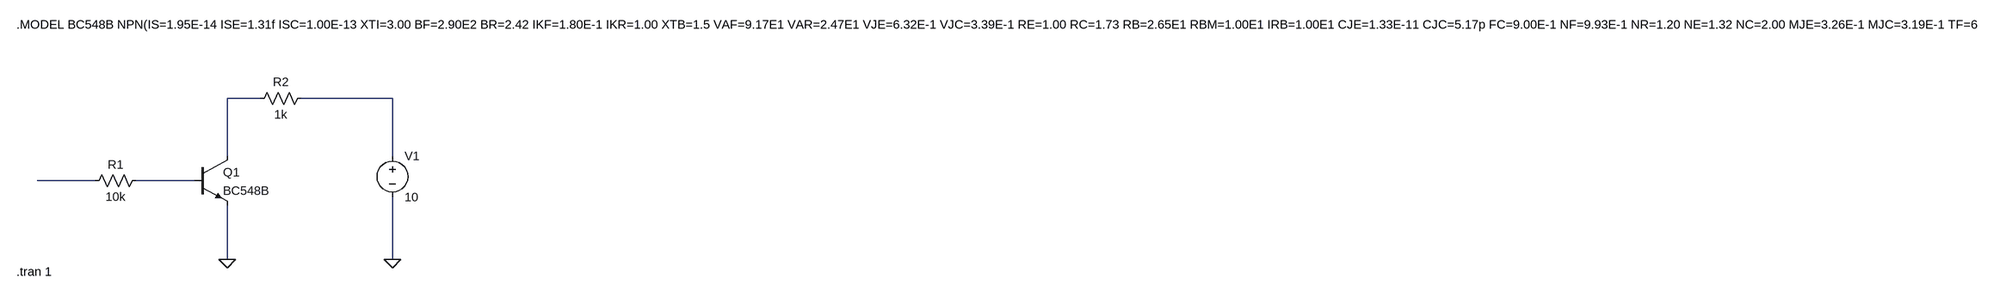
[diagram p0: schematic trans_corte.asc]
trans_corte.asc, the LTspice schematic file:
Version 4.1
SHEET 1 5068 680
WIRE 320 0 256 0
WIRE 576 0 400 0
WIRE 256 112 256 0
WIRE 576 112 576 0
WIRE 0 160 -112 160
WIRE 192 160 80 160
WIRE 256 320 256 208
WIRE 576 320 576 192
FLAG 256 320 0
FLAG 576 320 0
SYMBOL res 96 144 R90
WINDOW 0 0 56 VBottom 2
WINDOW 3 32 56 VTop 2
SYMATTR InstName R1
SYMATTR Value 10k
SYMBOL res 416 -16 R90
WINDOW 0 0 56 VBottom 2
WINDOW 3 32 56 VTop 2
SYMATTR InstName R2
SYMATTR Value 1k
SYMBOL voltage 576 96 R0
SYMATTR InstName V1
SYMATTR Value 10
SYMBOL npn 192 112 R0
SYMATTR InstName Q1
SYMATTR Value BC548B
TEXT -152 -144 Left 2 !.MODEL BC548B NPN(IS=1.95E-14 ISE=1.31f ISC=1.00E-13 XTI=3.00 BF=2.90E2 BR=2.42 IKF=1.80E-1 IKR=1.00 XTB=1.5 VAF=9.17E1 VAR=2.47E1 VJE=6.32E-1 VJC=3.39E-1 RE=1.00 RC=1.73 RB=2.65E1 RBM=1.00E1 IRB=1.00E1 CJE=1.33E-11 CJC=5.17p FC=9.00E-1 NF=9.93E-1 NR=1.20 NE=1.32 NC=2.00 MJE=3.26E-1 MJC=3.19E-1 TF=6.52E-10 TR=0 ITF=1.03 VTF=1.65 XTF=1.00E2 EG=1.11 VCEO=30 ICRATING=100m MFG=PHILIPS)
TEXT -152 344 Left 2 !.tran 1

The netlist it stands for:
* trans_corte.asc
R1 N004 N003 10k
R2 N002 N001 1k
V1 N002 0 10
Q1 N001 N004 0 0 BC548B
.model NPN NPN
.model PNP PNP
.lib standard.bjt
.MODEL BC548B NPN(IS=1.95E-14 ISE=1.31f ISC=1.00E-13 XTI=3.00 BF=2.90E2 BR=2.42 IKF=1.80E-1 IKR=1.00 XTB=1.5 VAF=9.17E1 VAR=2.47E1 VJE=6.32E-1 VJC=3.39E-1 RE=1.00 RC=1.73 RB=2.65E1 RBM=1.00E1 IRB=1.00E1 CJE=1.33E-11 CJC=5.17p FC=9.00E-1 NF=9.93E-1 NR=1.20 NE=1.32 NC=2.00 MJE=3.26E-1 MJC=3.19E-1 TF=6.52E-10 TR=0 ITF=1.03 VTF=1.65 XTF=1.00E2 EG=1.11 VCEO=30 ICRATING=100m MFG=PHILIPS)
.tran 1
.backanno
.end